# EAGLE design bloenk_final (EAGLE 6.6.0)
MY_DRAWING_NAME: Blönk
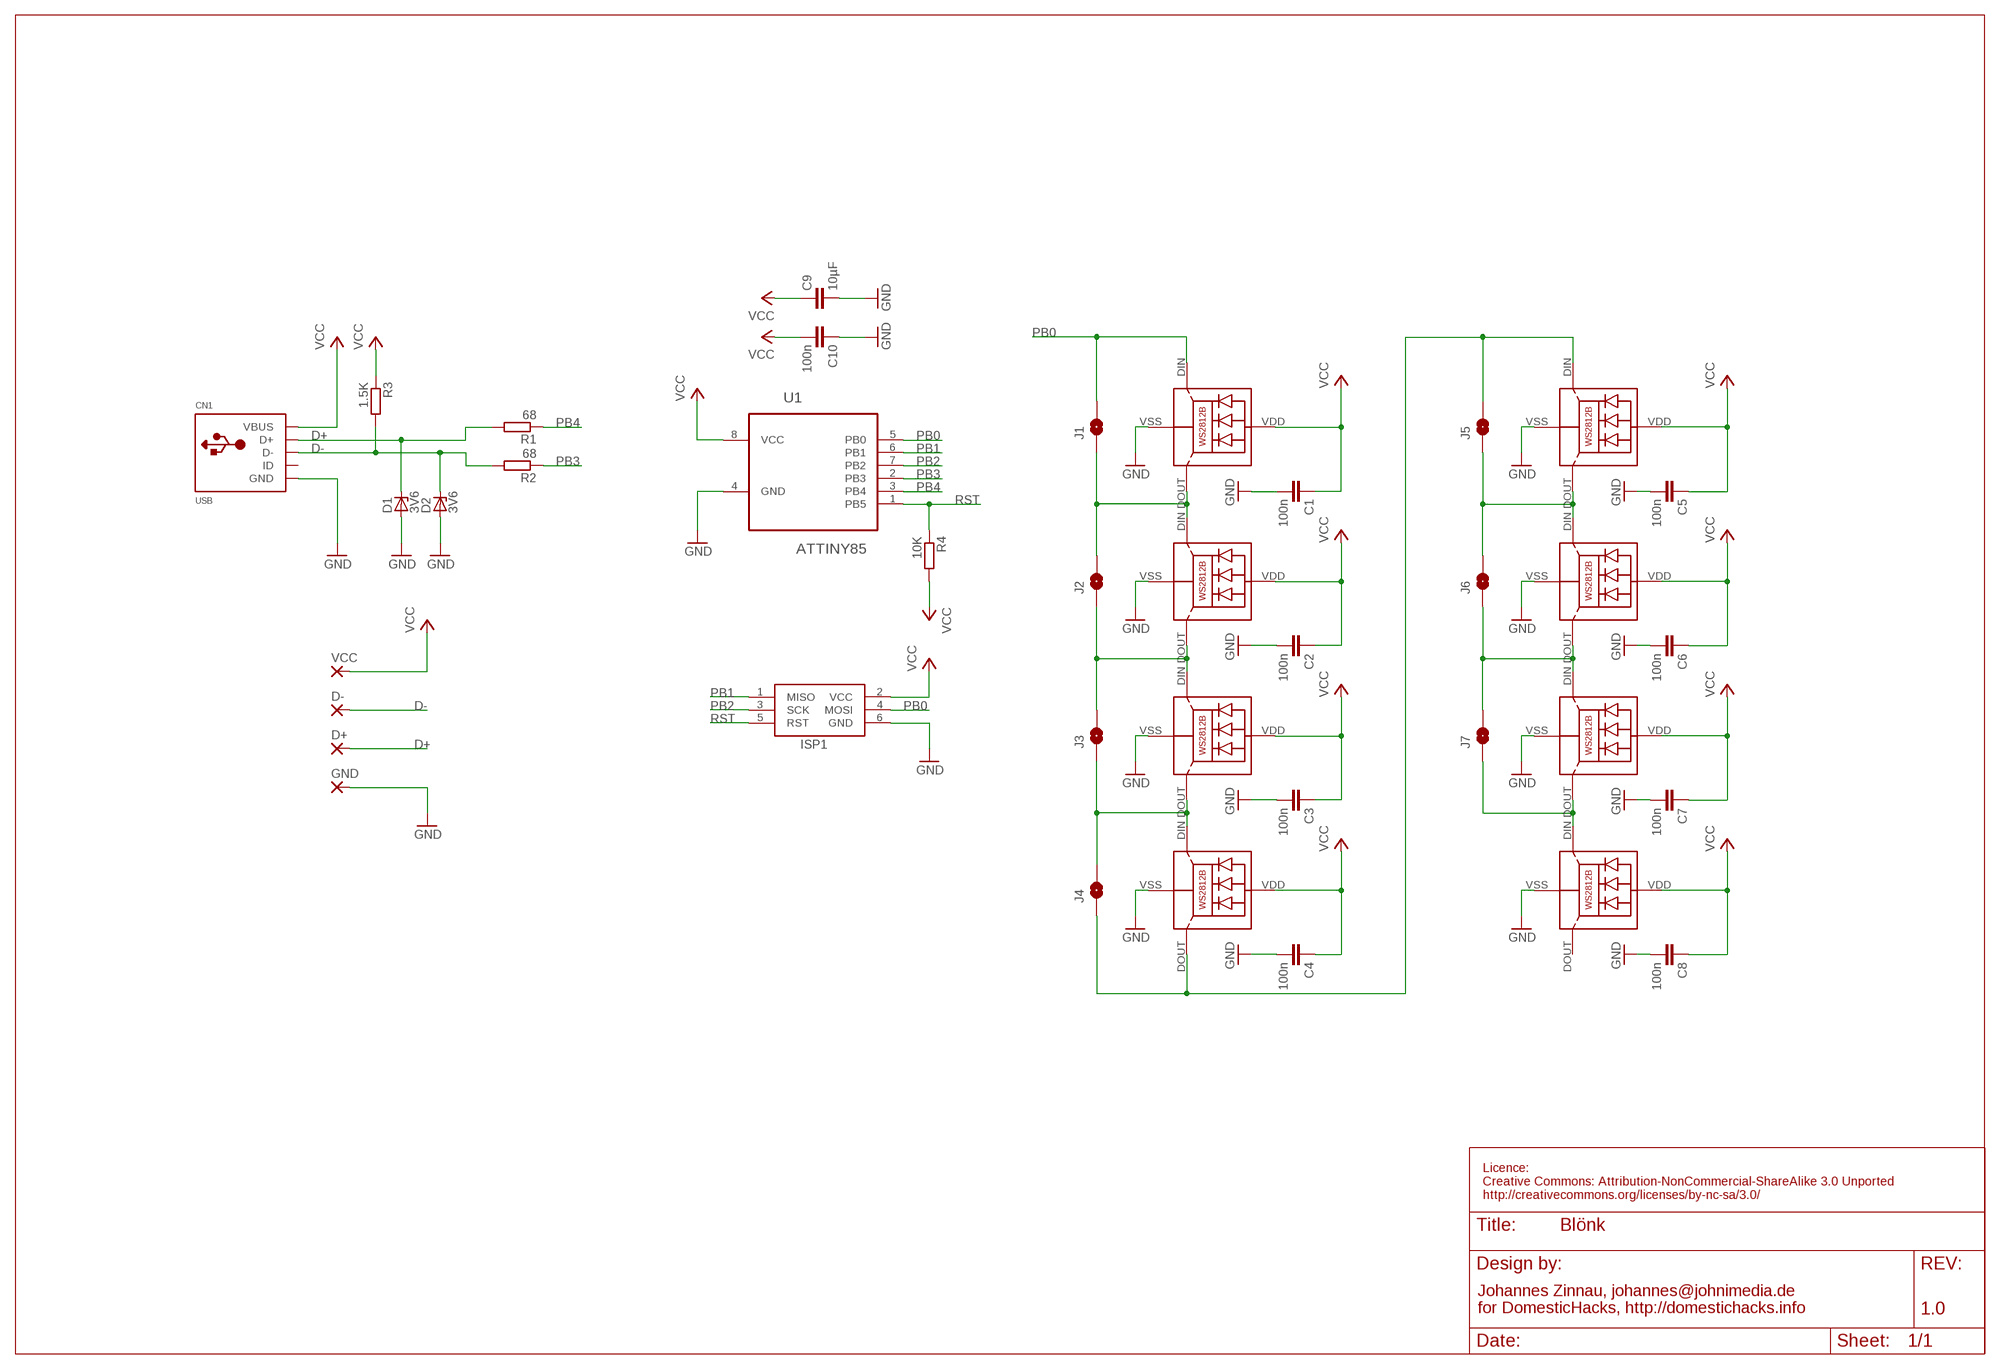
[diagram p0: schematic, sheet 1]

## Parts
C1  100n  C-EUC0603  [C0603]
C2  100n  C-EUC0603  [C0603]
C3  100n  C-EUC0603  [C0603]
C4  100n  C-EUC0603  [C0603]
C5  100n  C-EUC0603  [C0603]
C6  100n  C-EUC0603  [C0603]
C7  100n  C-EUC0603  [C0603]
C8  100n  C-EUC0603  [C0603]
C9  10µF  C-EUC0805  [C0805]
C10  100n  C-EUC0603  [C0603]
CN1  USB  USBMINIB  [USB-MINIB]
D1  3V6  ZENER-DIODESOD80C  [SOD80C]
D2  3V6  ZENER-DIODESOD80C  [SOD80C]
D+  SMD2  [SMD1,27-2,54]
D-  SMD2  [SMD1,27-2,54]
GND  SMD2  [SMD1,27-2,54]
ISP1  AVRISP-6  [AVRISP]
J1  SOLDERJUMPERNO  [SJ_2S-NO]
J2  SOLDERJUMPERNO  [SJ_2S-NO]
J3  SOLDERJUMPERNO  [SJ_2S-NO]
J4  SOLDERJUMPERNO  [SJ_2S-NO]
J5  SOLDERJUMPERNO  [SJ_2S-NO]
J6  SOLDERJUMPERNO  [SJ_2S-NO]
J7  SOLDERJUMPERNO  [SJ_2S-NO]
LED1  WS2812B  [WS2812B]
LED2  WS2812B  [WS2812B]
LED3  WS2812B  [WS2812B]
LED4  WS2812B  [WS2812B]
LED5  WS2812B  [WS2812B]
LED6  WS2812B  [WS2812B]
LED7  WS2812B  [WS2812B]
LED8  WS2812B  [WS2812B]
R1  68  R-EU_R0603  [R0603]
R2  68  R-EU_R0603  [R0603]
R3  1.5K  R-EU_R0603  [R0603]
R4  10K  R-EU_R0603  [R0603]
U1  ATTINY85  ATTINY85-20SU  [SOIC127P798X216-8N]
VCC  SMD2  [SMD1,27-2,54]

## Nets
D+: CN1.D+ D1.C D+.1(P) R1.2
D-: CN1.D- D2.C D-.1(P) R2.2 R3.2
GND: C1.2 C2.2 C3.2 C4.2 C5.2 C6.2 C7.2 C8.2 C9.2 C10.1 CN1.GND D1.A D2.A GND.1(P) ISP1.6(GND) LED1.VSS(GND) LED2.VSS(GND) LED3.VSS(GND) LED4.VSS(GND) LED5.VSS(GND) LED6.VSS(GND) LED7.VSS(GND) LED8.VSS(GND) U1.4(GND)
N$2: J2.1 J3.2 LED2.DOUT(DO) LED3.DIN(DI)
N$3: J3.1 J4.2 LED3.DOUT(DO) LED4.DIN(DI)
N$4: J1.1 J2.2 LED1.DOUT(DO) LED2.DIN(DI)
N$13: J5.1 J6.2 LED5.DOUT(DO) LED6.DIN(DI)
N$14: J6.1 J7.2 LED6.DOUT(DO) LED7.DIN(DI)
N$15: J7.1 LED7.DOUT(DO) LED8.DIN(DI)
N$16: J4.1 J5.2 LED4.DOUT(DO) LED5.DIN(DI)
PB0: ISP1.4(MOSI) J1.2 LED1.DIN(DI) U1.5(PB0)
PB1: ISP1.1(MISO) U1.6(PB1)
PB2: ISP1.3(SCK) U1.7(PB2)
PB3: R2.1 U1.2(PB3)
PB4: R1.1 U1.3(PB4)
RST: ISP1.5(RST) R4.1 U1.1(PB5)
VCC: C1.1 C2.1 C3.1 C4.1 C5.1 C6.1 C7.1 C8.1 C9.1 C10.2 CN1.VBUS ISP1.2(VCC) LED1.VDD LED2.VDD LED3.VDD LED4.VDD LED5.VDD LED6.VDD LED7.VDD LED8.VDD R3.1 R4.2 U1.8(VCC) VCC.1(P)
Unconnected: CN1.ID LED8.DOUT(DO)

## Notes on the sheet
- Licence: 
  Creative Commons: Attribution-NonCommercial-ShareAlike 3.0 Unported
  http://creativecommons.org/licenses/by-nc-sa/3.0/
- Johannes Zinnau, johannes@johnimedia.de 
  for DomesticHacks, http://domestichacks.info
- 1.0

## Library data of the parts
C1-C8 C10 = resistor:C-EU: CAPACITOR, European symbol
C9 = rcl:C-EU: CAPACITOR, European symbol
CN1 = adafruit:USB: USB Connectors USBMINIB - Surface Mount Female Mini-B USB Connector 4UConnector: 06564 By microbuilder.eu Thru-hole RA Female Mini-B USB Connector 4UConnector: 18732 By ladyada.net
D1 D2 = diode:ZENER-DIODE: Z-Diode
D+ D- GND VCC = wirepad:SMD2: SMD PAD
ISP1 = adafruit:AVRISP: AVR ISP HEADER Standard 6 pin header for AVR programming
J1-J7 = SparkFun-Passives:SOLDERJUMPER: Solder Jumper Standard SMD solder jumper. Used to automate production. Two varients : Normally Open and Normally Closed are the same, but have different paste layers. NC will have a large amount of paste and should jumper during reflow.
LED1-LED8 = WS2812B:WS2812B: Features and Benefits  * Intelligent reverse connect protection, the power supply reverse connection does not damage the IC. * The control circuit and the LED share the only power source. Control circuit and RGB chip are integrated in a package of 5050 components, form a complete control of pixel point.  * Built-in signal reshaping circuit, after wave reshaping to the next driver, ensure wave-form distortion not accumulate.  * Built-in electric reset circuit and power lost reset circuit.  * Each pixel of the three primary color can achieve 256 brightness display, completed 16777216 color full color display, and scan frequency not less than 400Hz/s.  * Cascading port transmission signal by single line.  * Any two point the distance more than 5m transmission signal without any increase circuit.  * When the refresh rate is 30fps, cascade number are not less than1024 points.  * Send data at speeds of 800Kbps.  *The color of the light were highly consistent, cost-effective. Applications  Full-color module, Full color soft lights a lamp strip. LED decorative lighting, Indoor/outdoor LED video irregular screen. General description WS2812B is a intelligent control LED light source that the control circuit and RGB chip are integrated in a package of 5050 components. It internal include intelligent digital port data latch and signal reshaping amplification drive circuit. Also include a precision internal oscillator and a 12V voltage programmable constant curre-nt control part, effectively ensuring the pixel point light color height consistent. The data transfer protocol use single NZR communication mode. After the pixel power-on reset, the DIN port receive data from controller, the first pixel collect initial 24bit data then sent to the internal data latch, the other data which reshaping by the internal signal reshaping amplification circuit sent to the next cascade pixel through the DO port. After transmission for each pixel,the signal to reduce 24bit. pixel adopt auto reshaping transmit technology, making the pixel cascade number is not limited the signal transmission, only depend on the speed of signal transmission. LED with low driving voltage, environmental protection and energy saving, high brightness, scattering angle is large, good consistency, low power, long life and other advantages. The control chip integrated in LED above becoming more simple circuit, small volume, convenient installation. Absolute Maximum Ratings Power supply voltage: VDD +3.5V..+5.3V Input voltage: VI -0.5V..VDD+0.5V based on WS2812 from https://github.com/adafruit/Adafruit-Eagle-Library
R1-R4 = resistor:R-EU_: RESISTOR, European symbol
U1 = Atmel_By_element14_Batch_1:ATTINY85-20SU: 8-bit Microcontroller with In-System Programmable Flash; MPN: ATTINY85-20SU; OC_FARNELL: 1455164; OC_NEWARK: 58M3797; PACKAGE: SOIC-8; SUPPLIER: Atmel

## Board
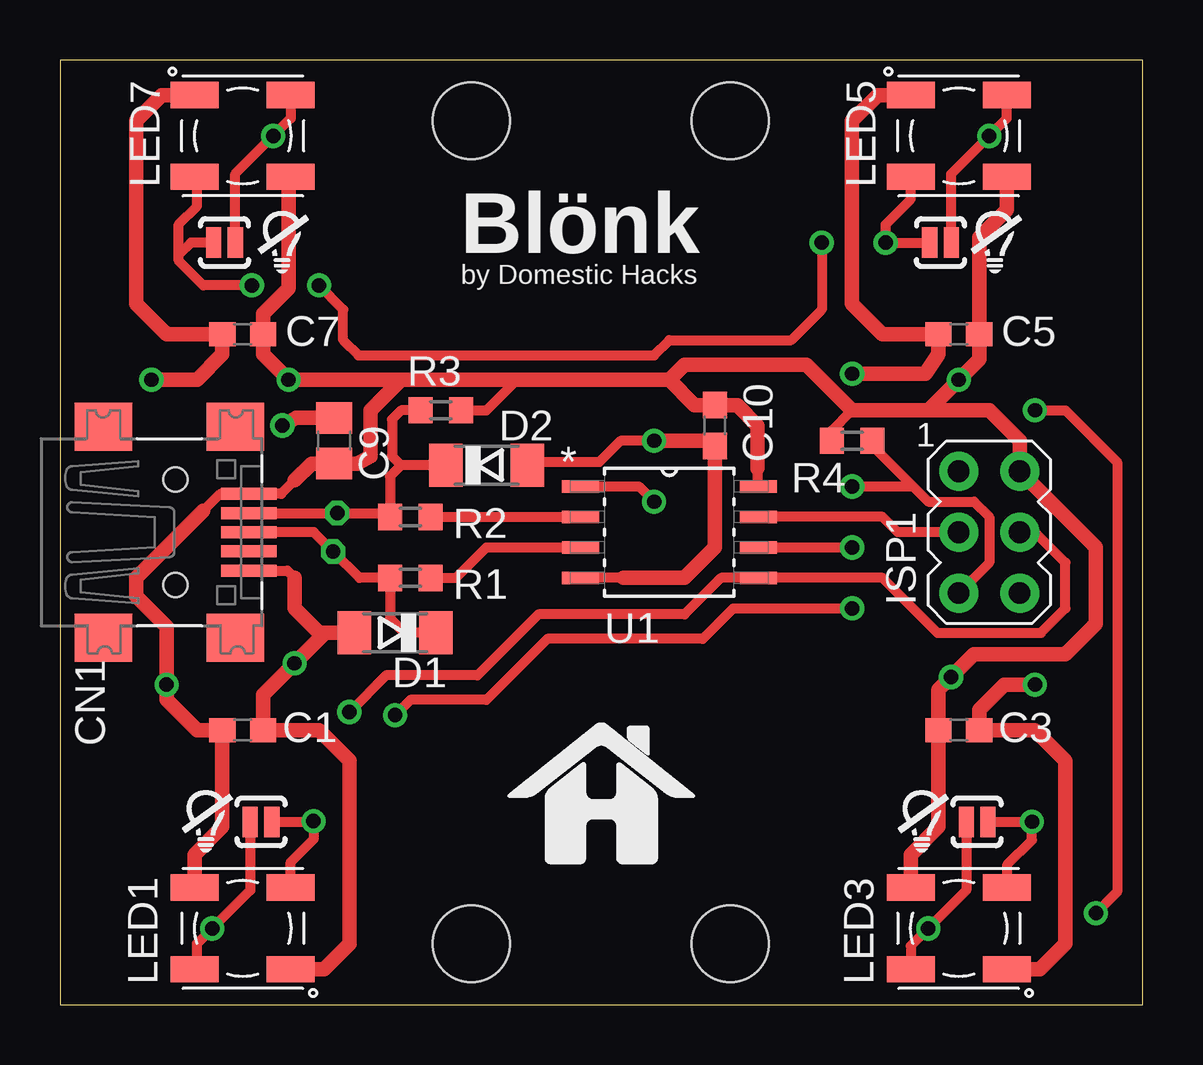
[diagram p1: board, top side]
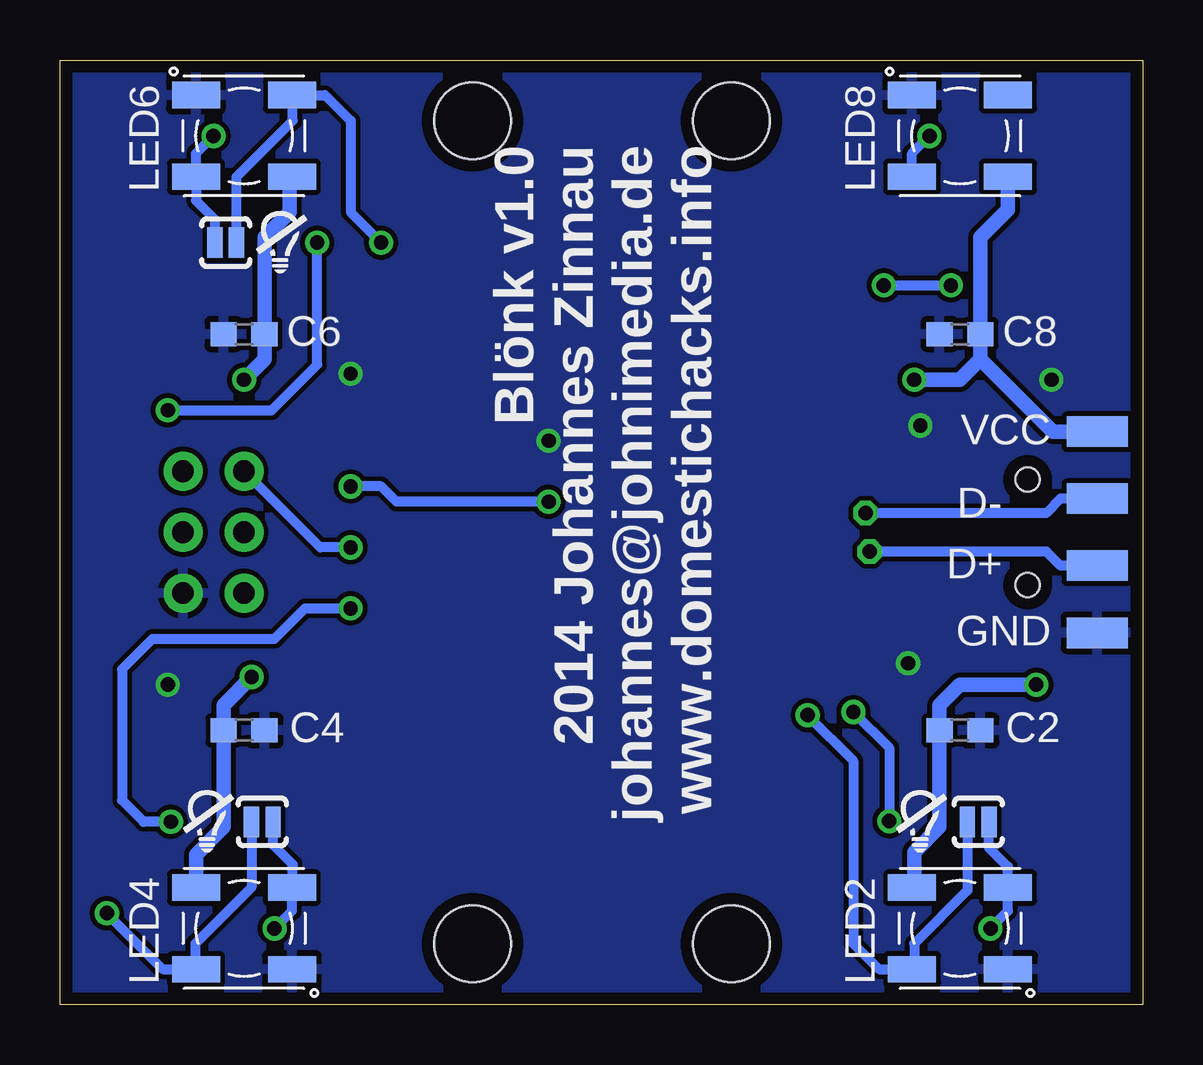
[diagram p2: board, bottom side, seen from below]

Size 45.14 x 39.36 mm. Coordinates in mm from the lower left corner, seen from the top.
Outline: 0,0 45.14,0 45.14,39.36 0,39.36 0,0
Copper layers (1*16): Top 0.035mm / dielectric 1.5mm / Bottom 0.035mm
Design rules "proto *": minimum track width 10mil, minimum drill 12mil, track to track 8mil, track to pad 8mil, pad to pad 8mil, via to via 8mil, smd to smd 8mil, copper to edge 20mil, drill to drill 10mil, minimum pad ring 10mil, minimum via ring 8mil, stop-mask expansion 4mil, vias tented up to drill 25mil, thermal gap 10mil
Holes 3.2 mm at 17.14,2.54 27.94,2.54 17.14,36.83 27.94,36.83

### Footprints (pad centres in the part's own frame; a part is rotated, then mirrored left to right if it is on the bottom)
C0603 = smd 1.1 x 1: 1 -0.85,0; 2 0.85,0
C0805 = smd 1.3 x 1.5: 1 -0.95,0; 2 0.95,0
USB-MINIB = smd 0.5 x 2.308: D+ 0,4.064; D- -0.8,4.064; GND 1.6,4.064; ID 0.8,4.064; VBUS -1.6,4.064 | smd 2 x 2.4: GND1 -4.4,-2; GND2 -4.4,3.5; GND3 4.4,3.5; GND4 4.4,-2 | hole 1: -2.2,1; 2.2,1
SOD80C = smd 1.4 x 1.8: A 1.7,0; C -1.7,0
SMD1,27-2,54 = smd 1.27 x 2.54: 1 0,0
AVRISP = drill 0.9 pad 1.626: 1 -1.27,2.54; 2 1.27,2.54; 3 -1.27,0; 4 1.27,0; 5 -1.27,-2.54; 6 1.27,-2.54
SJ_2S-NO = smd 0.635 x 1.27: 1 -0.45,0; 2 0.45,0
WS2812B = smd 2 x 1.1: DIN 2,1.7; DOUT -2,-1.7; VDD -2,1.7; VSS 2,-1.7
R0603 = smd 1 x 1.1: 1 -0.85,0; 2 0.85,0
SOIC127P798X216-8N = smd 1.549 x 0.533: 1 -3.708,1.905; 2 -3.708,0.635; 3 -3.708,-0.635; 4 -3.708,-1.905; 5 3.708,-1.905; 6 3.708,-0.635; 7 3.708,0.635; 8 3.708,1.905

### Placement (x,y rotation side)
C1  7.62,11.43 0 top
C2  7.62,11.43 0 bottom
C3  37.47,11.43 0 top
C4  37.47,11.43 0 bottom
C5  37.47,27.94 180 top
C6  37.47,27.94 180 bottom
C7  7.62,27.94 180 top
C8  7.62,27.94 180 bottom
C9  11.43,23.5 90 top
C10  27.3,24.13 90 top
CN1  3.81,19.68 270 top
D1  13.97,15.49 180 top
D2  17.78,22.48 0 top
D+  1.91,18.29 90 bottom
D-  1.91,21.08 90 bottom
GND  1.91,15.49 90 bottom
ISP1  38.73,19.68 0 top
J1  8.38,7.62 0 top
J2  6.86,7.62 0 bottom
J3  38.23,7.62 0 top
J4  36.7,7.62 0 bottom
J5  36.7,31.75 180 top
J6  38.23,31.75 180 bottom
J7  6.86,31.75 180 top
LED1  7.62,3.17 0 top
LED2  7.62,3.17 0 bottom
LED3  37.47,3.17 0 top
LED4  37.47,3.17 0 bottom
LED5  37.47,36.2 180 top
LED6  37.47,36.2 180 bottom
LED7  7.62,36.2 180 top
LED8  7.62,36.2 180 bottom
R1  14.61,17.78 180 top
R2  14.61,20.32 180 top
R3  15.88,24.77 180 top
R4  33.02,23.5 180 top
U1  25.4,19.68 0 top
U$1  [BULB]  5.08,6.35 0 top
U$2  [BULB]  34.92,6.35 0 top
U$3  [BULB]  8.25,30.48 0 top
U$4  [BULB]  37.97,30.48 0 top
U$5  [BULB]  10.29,6.35 0 bottom
U$6  [BULB]  40,6.35 0 bottom
U$7  [BULB]  36.96,30.48 0 bottom
U$9  [DH]  18.67,5.84 0 top
VCC  1.91,23.88 90 bottom

### Tracks (layer width: path | path; a pad name or v marks a point on that pad's centre or on a via)
D+  (via drill 0.6)
  Top 0.406: CN1.D+ 10.58,19.68 v11.39,18.88 12.48,17.78 R1.2 13.75,16.09 14.35,15.49 D1.C
  Bottom 0.406: D+.1 3.43,18.29 4.02,18.88 v11.39,18.88
D-  (via drill 0.6)
  Top 0.406: D2.C 14.22,22.48 | R3.2 14.22,24.77 13.84,24.38 13.84,22.86 14.22,22.48 | 14.22,22.48 13.75,22.01 R2.2 13.59,20.48 11.81,20.48 v11.56,20.48 CN1.D-
  Bottom 0.406: D-.1 3.43,21.08 4.03,20.48 v11.56,20.48
GND  (via drill 0.6)
  Top 0.305: 19.61,22.61 D2.A
  Top 0.406: 27.09,23.5 C10.1 | 9.62,1.81 LED1.VSS | v24.76,23.5 23.37,23.5 22.48,22.61 19.61,22.61 | 23.5,17.78 U1.4 | CN1.GND 9.47,18.09 9.78,17.78
  Top 0.61: C10.1 27.3,19.05 26.04,17.78 23.5,17.78 | v24.76,23.5 27.09,23.5 | LED1.VSS 11,1.48 12.07,2.54 12.07,10.16 10.79,11.43 C1.2 8.47,12.91 v9.78,14.22 11.05,15.49 D1.A 10.79,15.49 9.78,16.51 9.78,17.78 | LED3.VSS 40.84,1.48 41.91,2.54 41.91,10.16 40.64,11.43 C3.2 38.31,12.28 39.37,13.34 v40.64,13.34 | v3.81,26.04 5.71,26.04 6.77,27.09 C7.2 4.45,27.94 3.18,29.21 3.18,36.83 4.24,37.9 LED7.VSS | v33.02,26.29 36.07,26.29 36.61,27.09 C5.2 34.29,27.94 33.02,29.21 33.02,36.83 34.08,37.9 LED5.VSS | C9.2 9.84,24.45 v9.27,24.13
  pour Bottom: 0,39.37 45.08,39.37 45.08,0 0,0
N$2  (via drill 0.6)
  Top 0.406: v13.97,12.06 14.61,12.7 17.78,12.7 20.32,15.24 26.8,15.24 28.07,16.51 v33.02,16.51 | 39.5,4.91 39.5,5.84 40.51,6.86 v40.51,7.62 J3.2
  Top 0.61: 39.5,4.91 LED3.DIN
  Bottom 0.406: v13.97,12.06 12.07,10.16 12.07,2.54 11,1.48 LED2.DOUT 9.52,1.57 9.52,2.54 7.31,4.76 J2.1 | v33.02,16.51 34.92,16.51 36.19,15.24 41.28,15.24 42.55,13.97 42.55,8.51 41.66,7.62 v40.51,7.62
N$3  (via drill 0.6)
  Top 0.406: LED3.DOUT 35.47,2.44 v36.19,3.17 37.78,4.76 J3.1
  Bottom 0.406: 35.43,4.91 35.43,5.84 36.25,6.66 J4.2 | v36.19,3.17 35.47,3.9 LED4.DIN
  Bottom 0.61: 35.43,4.91 LED4.DIN
N$4  (via drill 0.6)
  Top 0.305: LED1.DOUT 5.71,1.57
  Top 0.406: 5.71,1.57 5.71,2.54 v6.35,3.17 7.93,4.76 J1.1
  Bottom 0.305: LED2.DIN arc-90 5.71,4.78
  Bottom 0.406: J2.2 6.41,6.54 5.62,5.75 LED2.DIN 5.62,3.9 v6.35,3.17
N$13  (via drill 0.6)
  Top 0.406: LED5.DOUT 39.47,36.92 v38.73,36.2 37.15,34.61 J5.1
  Bottom 0.406: v38.73,36.2 39.47,35.47 LED6.DIN 39.47,33.5 38.68,32.71 J6.2
N$14  (via drill 0.6)
  Top 0.406: 4.95,31.24 4.95,30.99 5.97,29.97 v8,29.97 | 4.95,31.24 4.95,32.51 5.71,33.27 5.71,34.4 | J7.2 5.46,31.75 4.95,31.24 | v10.79,29.97 11.81,28.96 11.81,27.69 12.45,27.05 24.76,27.05 25.4,27.69 30.48,27.69 31.75,28.96 v31.75,31.75
  Top 0.61: 5.71,34.4 LED7.DIN
  Bottom 0.305: LED6.DOUT 35.47,38.01 arc-90 35.56,38.1
  Bottom 0.406: J6.1 37.78,34.49 35.43,36.83 35.43,37.86 LED6.DOUT 34.08,37.9 33.02,36.83 33.02,33.02 v31.75,31.75 | v10.79,29.97 v8,29.97
N$15  (via drill 0.6)
  Top 0.406: LED7.DOUT 9.62,36.92 v8.89,36.2 7.31,34.61 J7.1
  Bottom 0.406: LED8.DIN 9.62,35.47 v8.89,36.2
N$16  (via drill 0.6)
  Top 0.406: v40.64,24.77 41.91,24.77 44.07,22.61 44.07,4.7 v43.18,3.81 | J5.2 v34.42,31.75 34.42,32.51 35.47,33.56 LED5.DIN
  Bottom 0.406: v43.18,3.81 40.84,1.48 LED4.DOUT 39.5,1.51 39.5,2.54 37.15,4.88 J4.1 | v40.64,24.77 36.32,24.77 34.42,26.67 v34.42,31.75
PB0  (via drill 0.6)
  Top 0.406: ISP1.4 40.64,19.68 41.91,18.41 41.91,16.51 40.89,15.49 36.58,15.49 34.29,17.78 U1.5 27.56,17.78 26.04,16.26 19.94,16.26 17.4,13.72 13.59,13.72 v12.07,12.19 | LED1.DIN 9.62,5.94 10.57,6.88 v10.57,7.64 10.29,7.62 J1.2
  Bottom 0.406: v12.07,12.19 10.57,10.69 v10.57,7.64
PB1  (via drill 0.6)
  Top 0.406: U1.6 v33.02,19.05
  Bottom 0.406: v33.02,19.05 34.29,19.05 ISP1.1
PB2
  Top 0.406: ISP1.3 34.92,19.68 34.29,20.32 U1.7
PB3
  Top 0.406: R2.1 U1.2
PB4
  Top 0.406: R1.1 16.51,17.78 17.78,19.05 U1.3
RST  (via drill 0.6)
  Top 0.305: R4.1 33.87,23.28
  Top 0.406: v24.76,20.95 24.13,21.59 U1.1 | v33.02,21.59 35.56,21.59 | 35.56,21.59 36.19,20.95 38.1,20.95 38.73,20.32 38.73,18.41 ISP1.5 | 33.87,23.28 35.56,21.59
  Bottom 0.406: v24.76,20.95 31.11,20.95 31.75,21.59 v33.02,21.59
VCC  (via drill 0.6)
  Top 0.305: R4.2 32.17,23.91
  Top 0.406: U1.8 28.79,21.59 | 29.21,21.69 U1.8 | LED7.VDD 9.52,34.4 | 32.17,23.91 33.02,24.77 | R3.1 17.78,24.77 19.05,26.04 | 5.97,20.57 6.68,21.29 CN1.VBUS 9.22,21.29 9.78,21.84 | 29.08,22.35 29.08,21.61 U1.8
  Top 0.61: 36.19,24.77 38.73,24.77 40,23.5 ISP1.2 43.18,19.05 43.18,15.88 41.91,14.61 38.1,14.61 v37.15,13.65 36.61,13.12 C3.1 36.61,7.41 35.47,6.25 LED3.VDD | 36.19,24.77 33.02,24.77 31.11,26.67 26.04,26.67 25.4,26.04 | LED1.VDD 5.62,6.25 6.77,7.41 C1.1 5.71,11.43 4.45,12.7 v4.45,13.34 4.45,15.75 3.18,17.02 3.18,17.78 5.97,20.57 | LED5.VDD 39.47,33.12 38.31,31.96 C5.1 38.31,26.89 v37.47,26.04 36.19,24.77 | 9.52,34.4 9.52,29.84 8.47,28.79 C7.1 8.47,27.09 v9.52,26.04 14.22,26.04 | 14.22,26.04 12.95,24.77 12.95,22.86 12.38,22.55 C9.1 10.48,22.55 9.78,21.84 | 14.22,26.04 19.05,26.04 25.4,26.04 | 25.4,26.04 26.46,24.98 C10.2 28.23,24.98 29.08,24.13 29.08,22.35
  Bottom 0.406: LED2.VDD 9.52,4.97 | 35.56,34.4 LED6.VDD
  Bottom 0.61: 9.52,4.97 9.52,6.35 8.47,7.41 C2.1 8.47,12.48 7.62,13.34 v4.45,13.34 | LED4.VDD 39.47,6.25 38.31,7.41 C4.1 38.31,12.48 v37.15,13.65 | v9.52,26.04 7.62,26.04 6.77,26.89 | 35.56,34.4 35.56,33.02 36.61,31.96 C6.1 36.61,26.89 v37.47,26.04 | 6.77,26.89 C8.1 6.77,31.96 5.62,33.12 LED8.VDD | VCC.1 3.76,23.88 6.77,26.89

### Text on the board
tNames: Blönk | by Domestic Hacks
bNames: Blönk v1.0 / 2014 Johannes Zinnau / johannes@johnimedia.de / www.domestichacks.info